# Altium schematic sheet Top_Sheet.SchDoc
size A4
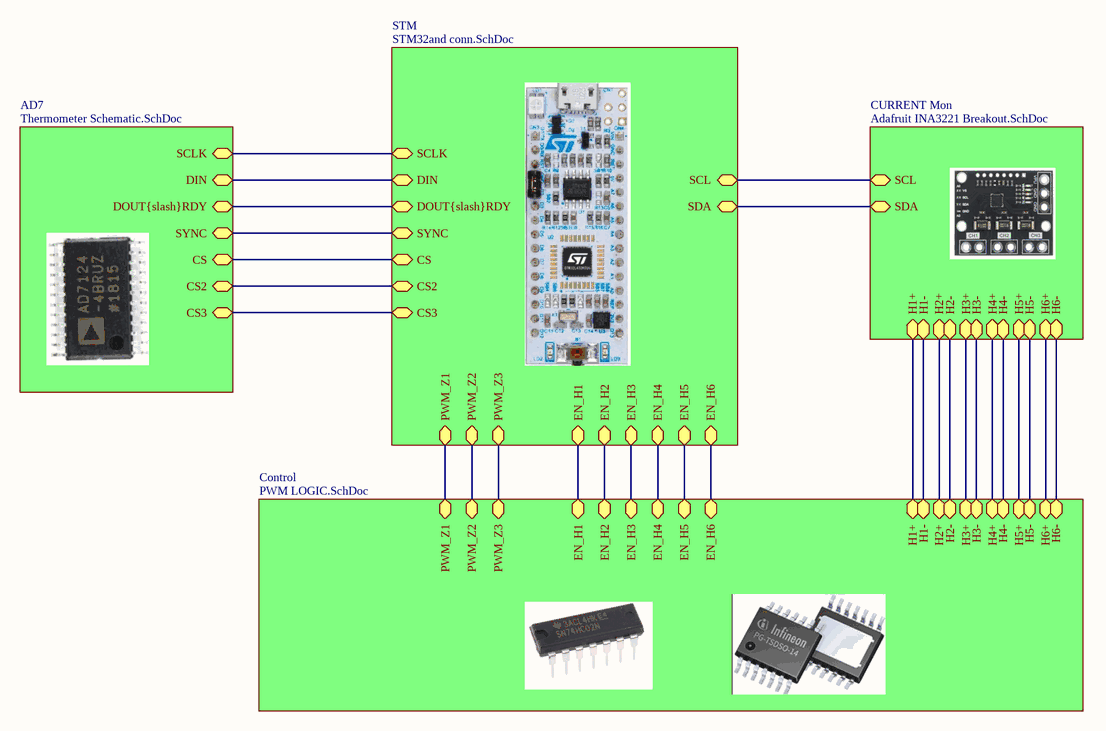
[diagram p0: Top_Sheet.SchDoc]

## Sub-sheets
AD7 = Thermometer Schematic.SchDoc: SCLK (bidir), DIN (bidir), DOUT{slash}RDY (bidir), SYNC (bidir), CS (bidir), CS2 (bidir), CS3 (bidir)
Control = PWM LOGIC.SchDoc: EN_H6 (bidir), EN_H5 (bidir), EN_H4 (bidir), EN_H3 (bidir), EN_H2 (bidir), EN_H1 (bidir), PWM_Z3 (bidir), PWM_Z2 (bidir), PWM_Z1 (bidir), H1+ (bidir), H1- (bidir), H2+ (bidir), H2- (bidir), H3+ (bidir), H3- (bidir), H4+ (bidir), H4- (bidir), H5+ (bidir), H5- (bidir), H6+ (bidir), H6- (bidir)
CURRENT Mon = Adafruit INA3221 Breakout.SchDoc: SCL (bidir), SDA (bidir), H1+ (bidir), H1- (bidir), H2+ (bidir), H2- (bidir), H3+ (bidir), H3- (bidir), H4+ (bidir), H4- (bidir), H5+ (bidir), H5- (bidir), H6+ (bidir), H6- (bidir)
STM = STM32and conn.SchDoc: SCL (bidir), SDA (bidir), SCLK (bidir), DIN (bidir), DOUT{slash}RDY (bidir), SYNC (bidir), CS (bidir), CS2 (bidir), CS3 (bidir), PWM_Z2 (bidir), PWM_Z3 (bidir), PWM_Z1 (bidir), EN_H1 (bidir), EN_H2 (bidir), EN_H4 (bidir), EN_H3 (bidir), EN_H5 (bidir), EN_H6 (bidir)

## Nets
(unnamed): sheet STM/SCL, sheet CURRENT Mon/SCL
(unnamed): sheet STM/SDA, sheet CURRENT Mon/SDA
(unnamed): sheet STM/SCLK, sheet AD7/SCLK
(unnamed): sheet STM/DIN, sheet AD7/DIN
(unnamed): sheet STM/DOUT{slash}RDY, sheet AD7/DOUT{slash}RDY
(unnamed): sheet STM/SYNC, sheet AD7/SYNC
(unnamed): sheet STM/CS, sheet AD7/CS
(unnamed): sheet STM/CS2, sheet AD7/CS2
(unnamed): sheet STM/CS3, sheet AD7/CS3
(unnamed): sheet STM/PWM_Z2, sheet Control/PWM_Z2
(unnamed): sheet STM/PWM_Z3, sheet Control/PWM_Z3
(unnamed): sheet STM/PWM_Z1, sheet Control/PWM_Z1
(unnamed): sheet STM/EN_H1, sheet Control/EN_H1
(unnamed): sheet STM/EN_H2, sheet Control/EN_H2
(unnamed): sheet STM/EN_H4, sheet Control/EN_H4
(unnamed): sheet STM/EN_H3, sheet Control/EN_H3
(unnamed): sheet STM/EN_H5, sheet Control/EN_H5
(unnamed): sheet STM/EN_H6, sheet Control/EN_H6
(unnamed): sheet CURRENT Mon/H1+, sheet Control/H1+
(unnamed): sheet CURRENT Mon/H1-, sheet Control/H1-
(unnamed): sheet CURRENT Mon/H2+, sheet Control/H2+
(unnamed): sheet CURRENT Mon/H2-, sheet Control/H2-
(unnamed): sheet CURRENT Mon/H3+, sheet Control/H3+
(unnamed): sheet CURRENT Mon/H3-, sheet Control/H3-
(unnamed): sheet CURRENT Mon/H4+, sheet Control/H4+
(unnamed): sheet CURRENT Mon/H4-, sheet Control/H4-
(unnamed): sheet CURRENT Mon/H5+, sheet Control/H5+
(unnamed): sheet CURRENT Mon/H5-, sheet Control/H5-
(unnamed): sheet CURRENT Mon/H6+, sheet Control/H6+
(unnamed): sheet CURRENT Mon/H6-, sheet Control/H6-